# Altium schematic sheet TOP.SchDoc
size A4
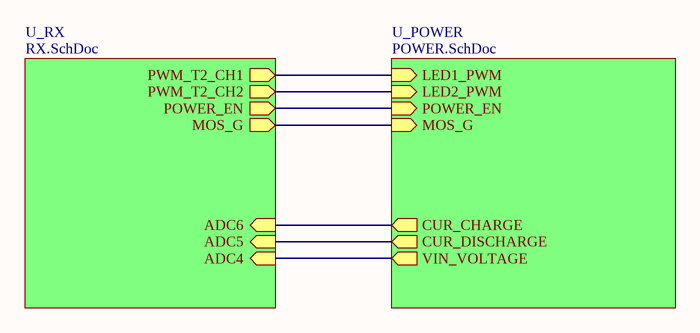
[diagram p0: TOP.SchDoc]

## Sub-sheets
U_POWER = POWER.SchDoc: CUR_CHARGE (out), CUR_DISCHARGE (out), POWER_EN (in), MOS_G (in), LED1_PWM (in), LED2_PWM (in), VIN_VOLTAGE (out)
U_RX = RX.SchDoc: PWM_T2_CH1 (out), PWM_T2_CH2 (out), ADC4 (in), ADC5 (in), ADC6 (in), POWER_EN (out), MOS_G (out)

## Nets
(unnamed): sheet U_POWER/CUR_CHARGE, sheet U_RX/ADC6
(unnamed): sheet U_POWER/CUR_DISCHARGE, sheet U_RX/ADC5
(unnamed): sheet U_POWER/POWER_EN, sheet U_RX/POWER_EN
(unnamed): sheet U_POWER/MOS_G, sheet U_RX/MOS_G
(unnamed): sheet U_POWER/LED1_PWM, sheet U_RX/PWM_T2_CH1
(unnamed): sheet U_POWER/LED2_PWM, sheet U_RX/PWM_T2_CH2
(unnamed): sheet U_POWER/VIN_VOLTAGE, sheet U_RX/ADC4